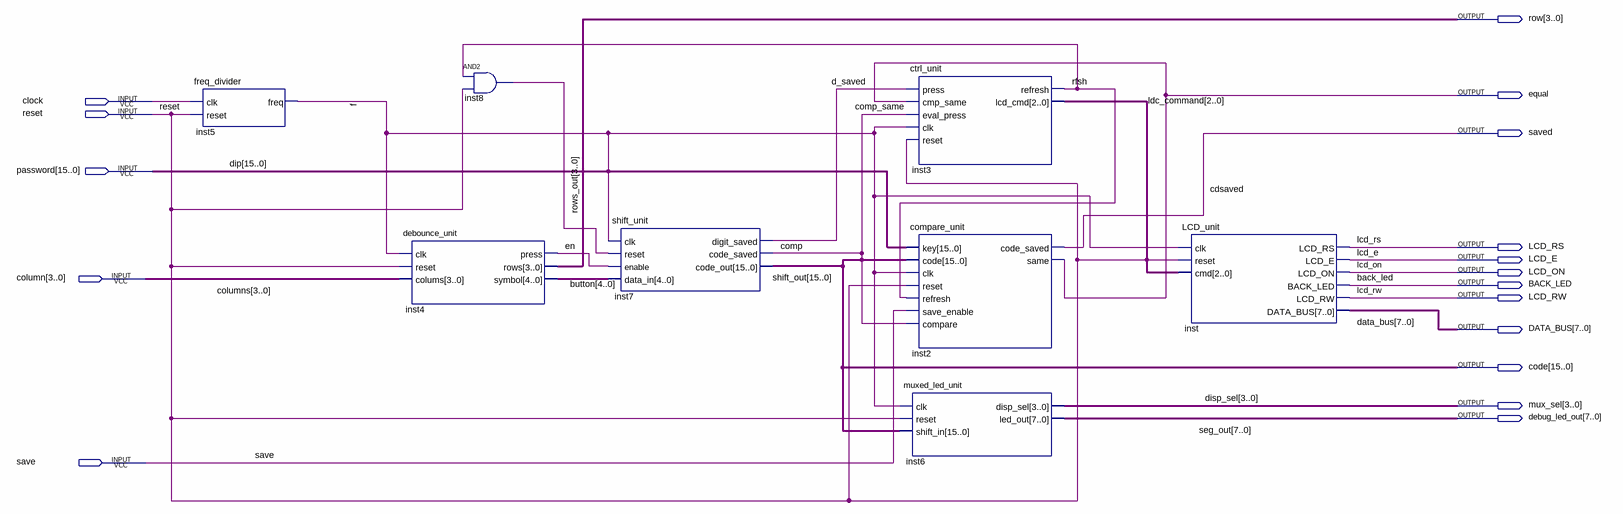
[diagram p0: schematic sheet]
// Quartus schematic Block2.bdf as structural Verilog: 8 symbols, 17 pins
module Block2 (
  input  clock,
  input  reset,
  input  [15:0] password,
  input  [3:0] column,
  input  save,
  output [3:0] row,
  output equal,
  output saved,
  output LCD_RS,
  output LCD_E,
  output LCD_ON,
  output BACK_LED,
  output LCD_RW,
  output [7:0] DATA_BUS,
  output [15:0] code,
  output [3:0] mux_sel,
  output [7:0] debug_led_out
);

  wire comp, d_saved, en, f, inst8_out, rfsh;
  wire [2:0] ldc_command;
  wire [4:0] button;

  freq_divider inst5 (.clk(clock), .reset(reset), .freq(f));
  debounce_unit inst4 (.clk(f), .reset(reset), .colums(column), .press(en), .rows(row), .symbol(button));
  and inst8 (inst8_out, rfsh, reset);
  shift_unit inst7 (
    .clk(f), .reset(inst8_out), .enable(en), .data_in(button), .digit_saved(d_saved), .code_saved(comp),
    .code_out(code));
  ctrl_unit inst3 (
    .press(d_saved), .cmp_same(equal), .eval_press(comp), .clk(f), .reset(reset), .refresh(rfsh),
    .lcd_cmd(ldc_command));
  compare_unit inst2 (
    .key(password), .code(code), .clk(f), .reset(reset), .refresh(rfsh), .save_enable(save), .compare(comp),
    .code_saved(saved), .same(equal));
  muxed_led_unit inst6 (.clk(f), .reset(reset), .shift_in(code), .disp_sel(mux_sel), .led_out(debug_led_out));
  LCD_unit inst (
    .clk(f), .reset(reset), .cmd(ldc_command), .LCD_RS(LCD_RS), .LCD_E(LCD_E), .LCD_ON(LCD_ON),
    .BACK_LED(BACK_LED), .LCD_RW(LCD_RW), .DATA_BUS(DATA_BUS));

  // Other names for the same wires on the sheet: cdsaved = saved; shift_out[15:0] = code; columns[3:0] = column;
  //   dip[15:0] = password; disp_sel[3:0] = mux_sel; comp_same = equal; rows_out[3:0] = row;
  //   seg_out[7:0] = debug_led_out
endmodule
